# EAGLE schematic MBUS reader through hole V0.1 (EAGLE 8.2.2)
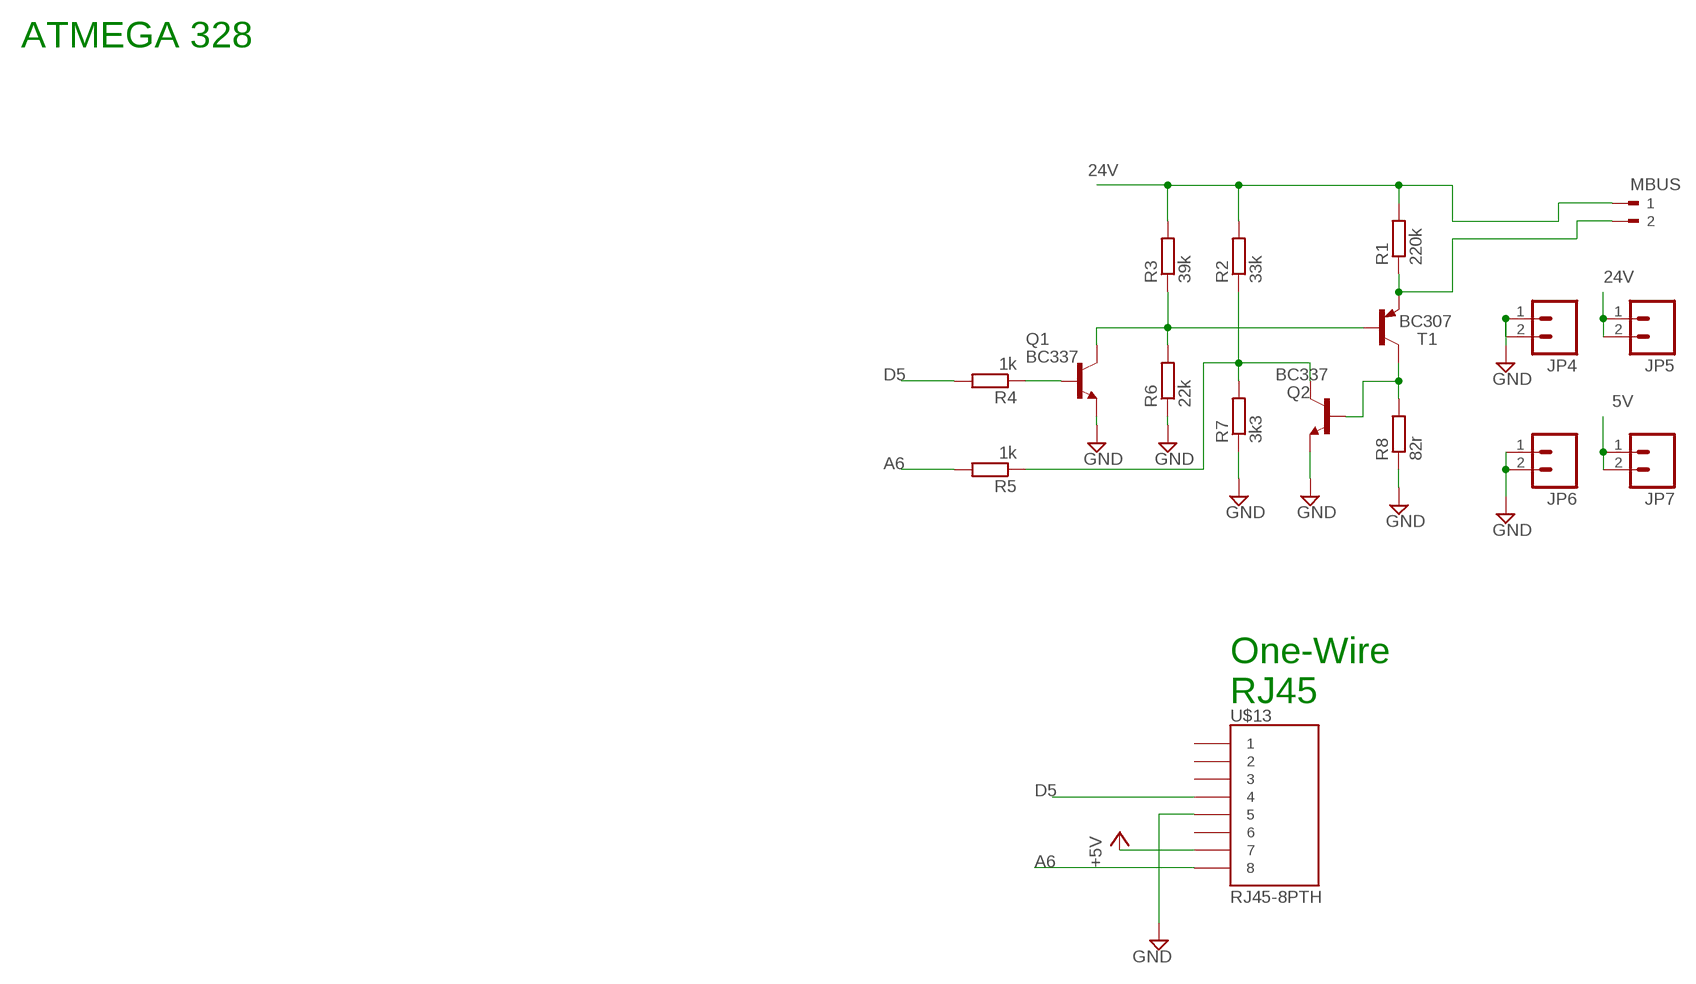
[diagram p0: schematic, sheet 1]

## Parts
JP4  M02PTH  [1X02]
JP5  M02PTH  [1X02]
JP6  M02PTH  [1X02]
JP7  M02PTH  [1X02]
MBUS  180-2  [180-2]
Q1  BC337  [TO92]
Q2  BC337  [TO92]
R1  220k  R-EU_0204/7  [0204/7]
R2  33k  R-EU_0204/7  [0204/7]
R3  39k  R-EU_0204/7  [0204/7]
R4  1k  R-EU_0204/7  [0204/7]
R5  1k  R-EU_0204/7  [0204/7]
R6  22k  R-EU_0204/7  [0204/7]
R7  3k3  R-EU_0204/7  [0204/7]
R8  82r  R-EU_0204/7  [0204/7]
T1  BC307  [TO92]
U$13  RJ45-8PTH  [RJ45-8]

## Nets
5V [power]: JP7.1 JP7.2 U$13.7 ; supply symbol labelled +5V
24V: JP5.1 JP5.2 MBUS.1 R1.2 R2.2 R3.2
A6: R5.2 U$13.8
D5: R4.2 U$13.4
GND [power]: JP4.1 JP4.2 JP6.1 JP6.2 Q1.1(E) Q2.1(E) R6.1 R7.1 R8.1 U$13.5
N$1: MBUS.2 R1.1 T1.1(E)
N$16: Q2.2(B) R8.2 T1.3(C)
N$18: Q1.3(C) R3.1 R6.2 T1.2(B)
N$21: Q2.3(C) R2.1 R5.1 R7.2
N$25: Q1.2(B) R4.1
Unconnected: U$13.1 U$13.2 U$13.3 U$13.6

## Notes on the sheet
- ATMEGA 328
- One-Wire
  RJ45

## Library data of the parts
JP4-JP7 = SparkFun:M02: Header 2 Standard 2-pin 0.1" header. Use with straight break away headers (SKU : PRT-00116), right angle break away headers (PRT-00553), swiss pins (PRT-00743), machine pins (PRT-00117), and female headers (PRT-00115). Molex polarized connector foot print use with SKU : PRT-08233 with associated crimp pins and housings.
MBUS = con-weidmueller-sl35:180-2: WEIDMUELLER CLAMP CONNECTOR; OC_FARNELL: unknown; OC_NEWARK: unknown
Q1 Q2 = transistor:BC337: NPN TRANSISTOR
R1-R8 = resistor:R-EU_: RESISTOR, European symbol
T1 = transistor-pnp:BC307: PNP Transistor
U$13 = SparkFun-Connectors:RJ45-8: RJ45 Jack Simple RJ45, 8-pin connection - connector for common Cat5, Cat5e, and Cat6 Ethernet cables. Footprint not yet proven in production. Connector sku is PRT-00643; Breakout PCB sku is BOB-00716.

## Net classes
0 default: width 0.203 mm, drill 0.6 mm, clearance 0.203 mm
1 power: width 0.381 mm, drill 0.6 mm, clearance 0.254 mm
2 gnd: width 0.254 mm, drill 0.6 mm, clearance 0.254 mm